# EAGLE design M115X (EAGLE 6.6.0)
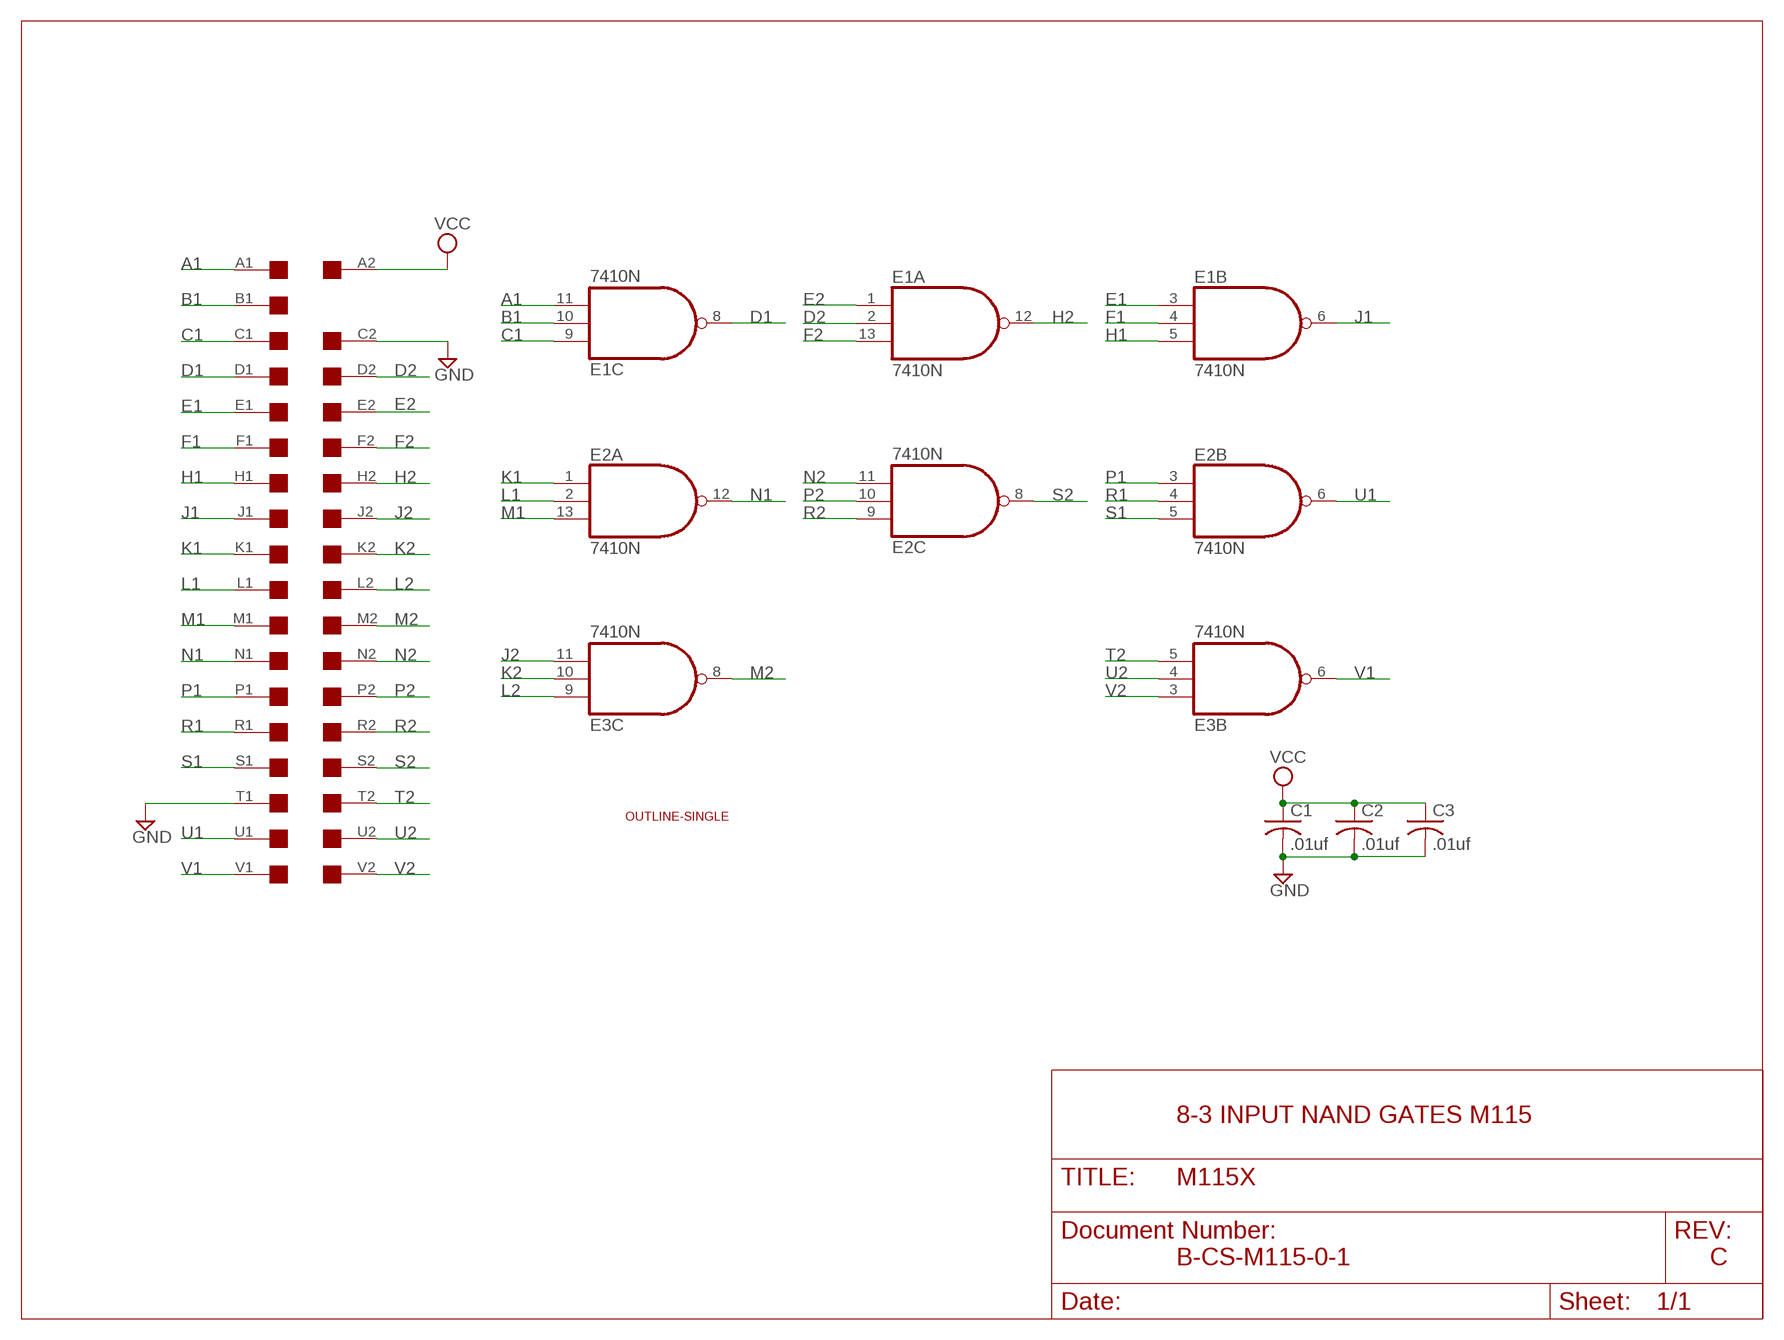
[diagram p0: schematic, sheet 1]

## Parts
C1  .01uf  C-US050-025X075  [C050-025X075]
C2  .01uf  C-US050-025X075  [C050-025X075]
C3  .01uf  C-US050-025X075  [C050-025X075]
E1  7410N  [DIL14]
E2  7410N  [DIL14]
E3  7410N  [DIL14]
U$1  SINGLE  [EDGE-CON2]
U$4  OUTLINE-SINGLE  [SINGLE]

## Nets
A1: E1.11(C:I2) U$1.A1
B1: E1.10(C:I1) U$1.B1
C1: E1.9(C:I0) U$1.C1
D1: E1.8(C:O) U$1.D1
D2: E1.2(A:I1) U$1.D2
E1: E1.3(B:I0) U$1.E1
E2: E1.1(A:I0) U$1.E2
F1: E1.4(B:I1) U$1.F1
F2: E1.13(A:I2) U$1.F2
GND [Supply]: C1.2 C2.2 C3.2 U$1.C2 U$1.T1
H1: E1.5(B:I2) U$1.H1
H2: E1.12(A:O) U$1.H2
J1: E1.6(B:O) U$1.J1
J2: E3.11(C:I2) U$1.J2
K1: E2.1(A:I0) U$1.K1
K2: E3.10(C:I1) U$1.K2
L1: E2.2(A:I1) U$1.L1
L2: E3.9(C:I0) U$1.L2
M1: E2.13(A:I2) U$1.M1
M2: E3.8(C:O) U$1.M2
N1: E2.12(A:O) U$1.N1
N2: E2.11(C:I2) U$1.N2
P1: E2.3(B:I0) U$1.P1
P2: E2.10(C:I1) U$1.P2
R1: E2.4(B:I1) U$1.R1
R2: E2.9(C:I0) U$1.R2
S1: E2.5(B:I2) U$1.S1
S2: E2.8(C:O) U$1.S2
T2: E3.5(B:I2) U$1.T2
U1: E2.6(B:O) U$1.U1
U2: E3.4(B:I1) U$1.U2
V1: E3.6(B:O) U$1.V1
V2: E3.3(B:I0) U$1.V2
VCC [Supply]: C1.1 C2.1 C3.1 U$1.A2
Unconnected: E3.1(A:I0) E3.2(A:I1) E3.12(A:O) E3.13(A:I2) U$1.B2

## Notes on the sheet
- 8-3 INPUT NAND GATES M115
- B-CS-M115-0-1 | C

## Power pins joined to a net without a drawn wire
GND: E1.7(P:GND) E2.7(P:GND) E3.7(P:GND)
VCC: E1.14(P:VCC) E2.14(P:VCC) E3.14(P:VCC)

## Library data of the parts
C1-C3 = rcl:C-US: CAPACITOR, American symbol
E1-E3 = 74xx-us:74*10: Triple 3-input NAND gate
U$1 = dec-con:SINGLE: Single-Height DEC board
U$4 = dec-con:OUTLINE-*: Board outlines for DEC boards.

## Net classes
1 Supply: width 0.813 mm

## Board
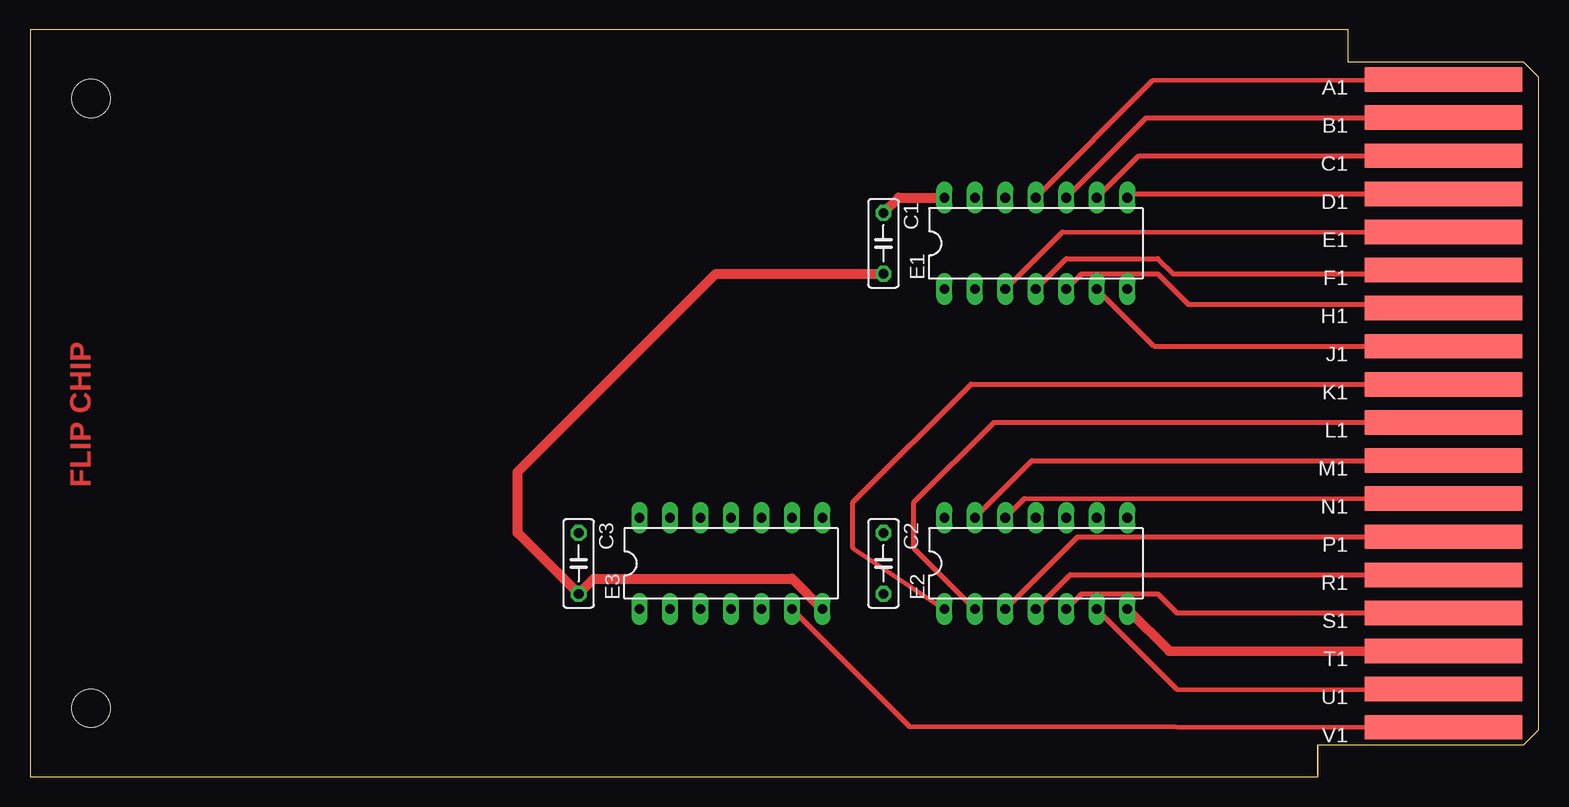
[diagram p1: board, top side]
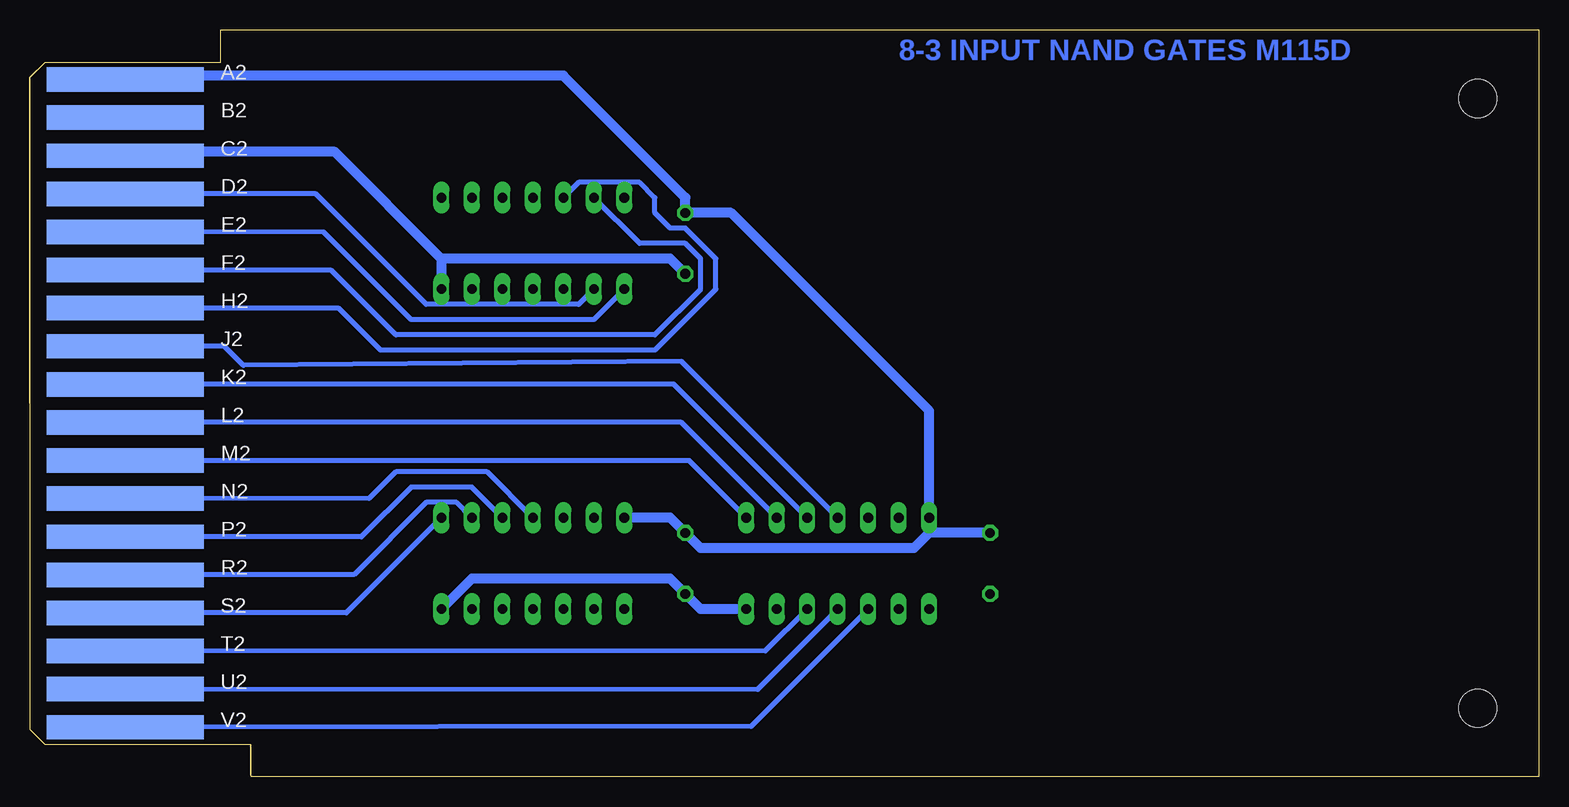
[diagram p2: board, bottom side, seen from below]

Size 125.73 x 62.23 mm. Coordinates in mm from the lower left corner, seen from the top.
Copper layers (1+16): Top 0.035mm / dielectric 1.5mm / Bottom 0.035mm
Design rules "16mils": minimum track width 16mil, minimum drill 32mil, track to track 15mil, track to pad 10mil, pad to pad 10mil, via to via 10mil, smd to smd 10mil, copper to edge 13mil, drill to drill 10mil, minimum pad ring 10mil, minimum via ring 8mil, stop-mask expansion 0mil, vias tented up to drill 0mil, thermal gap 10mil

### Footprints (pad centres in the part's own frame; a part is rotated, then mirrored left to right if it is on the bottom)
C050-025X075 = drill 0.813 octagon: 1 -2.54,0; 2 2.54,0
DIL14 = drill 0.813 long: 1 -7.62,-3.81; 2 -5.08,-3.81; 3 -2.54,-3.81; 4 0,-3.81; 5 2.54,-3.81; 6 5.08,-3.81; 7 7.62,-3.81; 8 7.62,3.81; 9 5.08,3.81; 10 2.54,3.81; 11 0,3.81; 12 -2.54,3.81; 13 -5.08,3.81; 14 -7.62,3.81
EDGE-CON2 = smd 13.106 x 2.032: A1 7.938,4.128; B1 7.938,7.303; C1 7.938,10.477; D1 7.938,13.652; E1 7.938,16.828; F1 7.938,20.003; H1 7.938,23.177; J1 7.938,26.352; K1 7.938,29.527; L1 7.938,32.703; M1 7.938,35.877; N1 7.938,39.053; P1 7.938,42.227; R1 7.938,45.403; S1 7.938,48.578; T1 7.938,51.752; U1 7.938,54.928; V1 7.938,58.102 | smd 13.106 x 2.032 bottom: A2 7.938,4.128; B2 7.938,7.303; C2 7.938,10.477; D2 7.938,13.652; E2 7.938,16.828; F2 7.938,20.003; H2 7.938,23.177; J2 7.938,26.352; K2 7.938,29.527; L2 7.938,32.703; M2 7.938,35.877; N2 7.938,39.053; P2 7.938,42.227; R2 7.938,45.403; S2 7.938,48.578; T2 7.938,51.752; U2 7.938,54.928; V2 7.938,58.102
SINGLE = hole 3.175: 120.65,56.515; 120.65,5.715

### Placement (x,y rotation side)
C1  71.12,44.45 270 top
C2  71.12,17.78 270 top
C3  45.72,17.78 270 top
E1  83.82,44.45 0 top
E2  83.82,17.78 0 top
E3  58.42,17.78 0 top
U$1  125.73,62.23 180 top
U$4  125.73,62.23 180 top

### Tracks (layer width: path | path; a pad name or v marks a point on that pad's centre or on a via)
A1
  Top 0.406: U$1.A1 93.58,58.02 E1.11
B1
  Top 0.406: U$1.B1 93,54.9 E1.10
C1
  Top 0.406: U$1.C1 92.38,51.74 E1.9
D1
  Top 0.406: U$1.D1 91.75,48.56 E1.8
D2
  Bottom 0.406: U$1.D2 101.91,48.56 92.71,39.37 80.01,39.37 E1.2
E1
  Top 0.406: U$1.E1 86.03,45.39 E1.3
E2
  Bottom 0.406: U$1.E2 101.27,45.39 93.98,38.1 78.74,38.1 E1.1
F1
  Top 0.406: U$1.F1 112.04,42.19 111.76,41.91 95.25,41.91 93.98,43.18 86.36,43.18 E1.4
F2
  Bottom 0.406: U$1.F2 100.61,42.19 95.25,36.83 73.66,36.83 69.85,40.64 69.85,43.18 71.12,44.45 74.93,44.45 E1.13
GND
  Top 0.813: U$1.T1 94.92,10.49 E2.7 | C1.2 57.15,41.91 40.64,25.4 40.64,20.32 C3.2 46.99,16.51 63.5,16.51 E3.7
  Bottom 0.813: U$1.C2 112.09,51.74 111.76,52.07 100.33,52.07 91.44,43.18 | 91.44,43.18 E1.7 | C1.2 72.39,43.18 91.44,43.18 | E3.7 69.85,13.97 C2.2 72.39,16.51 88.9,16.51 E2.7
H1
  Top 0.406: U$1.H1 112.09,39.04 111.76,39.37 96.52,39.37 93.98,41.91 87.63,41.91 E1.5
H2
  Bottom 0.406: U$1.H2 100,39.04 96.52,35.56 73.66,35.56 68.58,40.64 68.58,43.18 71.12,45.72 72.39,45.72 73.66,46.99 73.66,48.26 74.93,49.53 80.01,49.53 E1.12
J1
  Top 0.406: U$1.J1 93.65,35.89 E1.6
J2
  Bottom 0.406: U$1.J2 109.55,35.89 107.95,34.29 71.45,34.62 E3.11
K1
  Top 0.406: U$1.K1 78.44,32.72 68.58,22.86 68.58,19.05 E2.1
K2
  Bottom 0.406: U$1.K2 72.08,32.72 E3.10
L1
  Top 0.406: U$1.L1 80.34,29.54 73.66,22.86 73.66,19.05 E2.2
L2
  Bottom 0.406: U$1.L2 71.45,29.54 E3.9
M1
  Top 0.406: U$1.M1 83.49,26.34 E2.13
M2
  Bottom 0.406: U$1.M2 70.79,26.34 E3.8
N1
  Top 0.406: U$1.N1 82.88,23.19 E2.12
N2
  Bottom 0.406: U$1.N2 97.46,23.19 95.25,25.4 87.63,25.4 E2.11
P1
  Top 0.406: U$1.P1 87.3,19.99 E2.3
P2
  Bottom 0.406: U$1.P2 98.12,19.99 93.98,24.13 88.9,24.13 E2.10
R1
  Top 0.406: U$1.R1 86.69,16.84 E2.4
R2
  Bottom 0.406: U$1.R2 98.73,16.84 92.71,22.86 90.17,22.86 E2.9
S1
  Top 0.406: U$1.S1 95.56,13.66 93.98,15.24 87.63,15.24 E2.5
S2
  Bottom 0.406: U$1.S2 99.36,13.66 E2.8
T2
  Bottom 0.406: U$1.T2 64.44,10.49 E3.5
U1
  Top 0.406: U$1.U1 95.61,7.26 E2.6
U2
  Bottom 0.406: U$1.U2 65.13,7.26 E3.4
V1
  Top 0.406: U$1.V1 73.27,4.2 E3.6
V2
  Bottom 0.406: U$1.V2 65.65,4.2 E3.3
VCC
  Top 0.813: C1.1 72.39,48.26 E1.14
  Bottom 0.813: U$1.A2 117.72,58.42 81.28,58.42 71.12,48.26 C1.1 67.31,46.99 50.8,30.48 E3.14 50.8,20.32 | C3.1 50.8,20.32 | E2.14 72.39,21.59 C2.1 69.85,19.05 52.07,19.05 50.8,20.32

### Text on the board
Top: FLIP CHIP
Bottom: 8-3 INPUT NAND GATES M115D